# Altium schematic sheet AICat .SchDoc
size A3
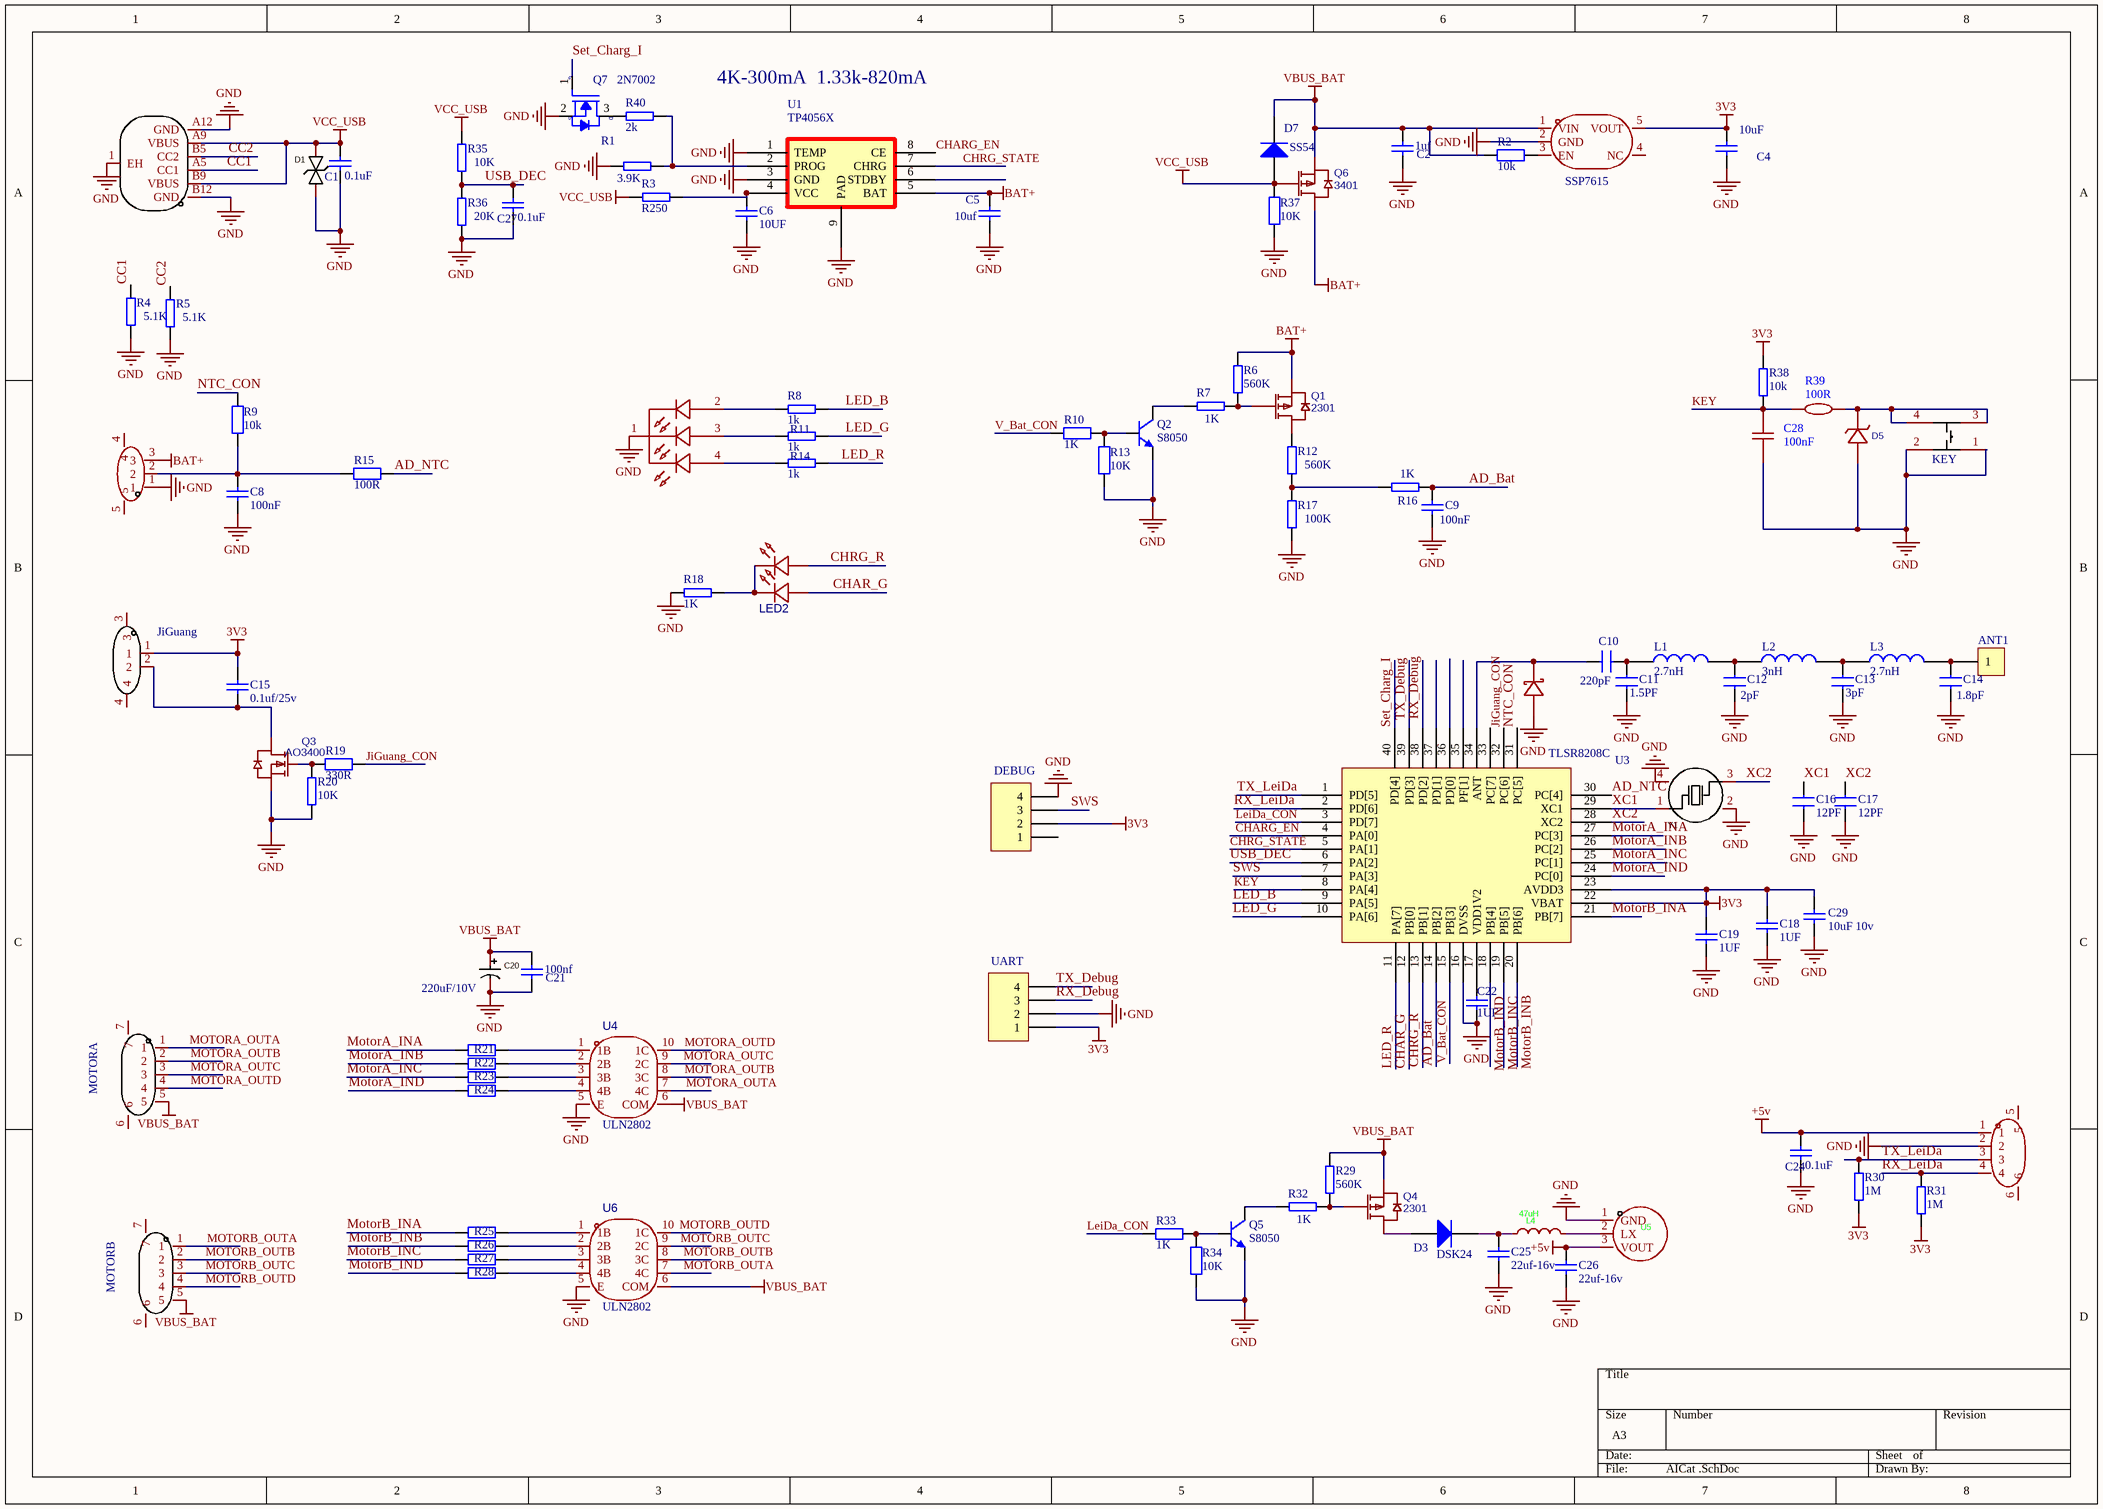
[diagram p0: AICat .SchDoc]

## Parts
ANT1  (no value)  [tp]
BAT1  BX-PH2.0-3PWT  [HDR-TH_3P-P2.50_ZX-XH2.54-3PWZ]  (value not drawn)
C1  0.1uF  [0603_C]
C2  1uf  [0603_C]
C4  10uF  [0603_C]
C5  10uf  [0603_C]
C6  10UF  [0603_c]
C8  100nF  [0603_C]
C9  100nF  [0603_C]
C10  220pF  [C0402]
C11  1.5PF  [C0402]
C12  2pF  [C0402]
C13  3pF  [C0402]
C14  1.8pF  [C0402]
C15  0.1uf/25v  [0603_C]
C16  12PF  [0603_c]
C17  12PF  [0603_c]
C18  1UF  [0603_c]
C19  1UF  [0603_c]
C20  220uF/10V  [SMD 6.3*5.4 电解]
C21  100nf  [0603_C]
C22  1UF  [0603_c]
C24  0.1uF  [0603_C]
C25  22uf-16v  [0805_c]
C26  22uf-16v  [0805_c]
C27  0.1uF  [0603_C]
C28  100nF  [0603_c]
C29  10uF 10v  [0603_C]
CN1  JiGuang  [CONN-SMD_2P-P1.25-LT]
CN2  HC-1.25-4PLT  [CONN-SMD_4P-P1.25_LT]  (value not drawn)
D1  SMF5.0CA_C726939  [SOD-123 双向]  (value not drawn)
D2  SE6V3LHN102T 6.3v单向  [0402-D]  (value not drawn)
D3  DSK24  [SOD-123FL]
D5  esd5z5.0t1g-ms  [SOD-523_L1.2-W0.8-LS1.6-RD]  (value not drawn)
D7  SS54  [SMA]
J1  MOTORA  [CONN-SMD_1.25-5PLT]
J2  MOTORB  [CONN-SMD_1.25-5PLT]
K1  KEY  [KEY_SMD_4P]
L1  2.7nH  [R0402]
L2  3nH  [R0402]
L3  2.7nH  [R0402]
L4  47uH  [IND-SMD_L3.5-W3.0_CD31]
LED1  XL-A3528RGBC-BM  [LED-ARRAY-SMD_4P-L3.2-W2.8-LS3.5-BL_XL-A3528RGBC-BM]  (value not drawn)
LED2  *  [LED-SMD_4P-L3.2-W1.6-TL_XL-3216SURUGC]  (value not drawn)
P1  DEBUG  [SIP4-2.54]
P2  UART  [SIP4-2.54]
Q1  2301  [SOT-23]
Q2  S8050  [SOT-23(SOT-23-3)]
Q3  AO3400  [SOT-23]
Q4  2301  [SOT-23]
Q5  S8050  [SOT-23(SOT-23-3)]
Q6  3401  [SOT-23]
Q7  2N7002  [SOT-23]
R1  3.9K  [0603_R]
R2  10k  [0603_R]
R3  R250  [1206_R]
R4  5.1K  [0603_R]
R5  5.1K  [0603_R]
R6  560K  [0603_R]
R7  1K  [0603_R]
R8  1k  [0603_R]
R9  10k  [0603_R]
R10  1K  [0603_r]
R11  1k  [0603_R]
R12  560K  [0603_R]
R13  10K  [0603_r]
R14  1k  [0603_R]
R15  100R  [0603_R]
R16  1K  [0603_R]
R17  100K  [0603_R]
R18  1K  [0603_R]
R19  330R  [0603_R]
R20  10K  [0603_R]
R21  330R  [0603_R]  (value not drawn)
R22  330R  [0603_R]  (value not drawn)
R23  330R  [0603_R]  (value not drawn)
R24  330R  [0603_R]  (value not drawn)
R25  330R  [0603_R]  (value not drawn)
R26  330R  [0603_R]  (value not drawn)
R27  330R  [0603_R]  (value not drawn)
R28  330R  [0603_R]  (value not drawn)
R29  560K  [0603_R]
R30  1M  [0603_R]
R31  1M  [0603_R]
R32  1K  [0603_R]
R33  1K  [0603_r]
R34  10K  [0603_r]
R35  10K  [0603_R]
R36  20K  [0603_R]
R37  10K  [0603_R]
R38  10k  [0603_R]
R39  100R  [0603_r]
R40  2k  [0603_R]
U1  TP4056X  [SOP8-9]
U2  SSP7615  [SOT-23-5]
U3  TLSR8208C  [QFN-40_L5.0-W5.0-P0.40-BL-EP3.7]
U4  ULN2802  [ESSOP-10]
U5  HE9116A50NR  [SOT-23]  (value not drawn)
U6  ULN2802  [ESSOP-10]
USB1  TYPE-C 6P  [TPYE-C-6]  (value not drawn)
Y1  24MHz +-20PPM  [CRYSTAL-SMD_4P-L3.2-W2.5]  (value not drawn)

## Nets
3V3: C4.2 C15.2 C18.1 C19.1 C29.2 CN1.1 P1.2 P2.1 R30.2 R31.2 R38.2 U2.5(VOUT) U3.22(VBAT) U3.23(AVDD3)
+5v: C24.2 C26.1 CN2.1 U5.3(VOUT)
BAT+: BAT1.3 C5.1 Q1.2(S) Q6.3(D) R6.1 U1.5(BAT)
GND: BAT1.1 C1.1 C2.1 C4.1 C5.2 C6.1 C8.2 C9.1 C11.1 C12.1 C13.1 C14.1 C16.1 C17.1 C18.2 C19.2 C20.2 C21.1 C22.1 C24.1 C25.2 C26.2 C27.1 C28.1 C29.1 CN2.2 D1.1 D2.2(A) D5.2(A) K1.1 K1.2 LED1.1 P1.4 P2.2 Q2.2(E) Q3.2(S) Q5.2(E) Q7.2(SOURCE) R1.1 R4.2 R5.2 R13.1 R17.2 R18.1 R20.1 R34.1 R36.2 R37.1 U1.1(TEMP) U1.3(GND) U1.9(PAD) U2.2(GND) U3.16(DVSS) U4.5(E) U5.1(GND) U6.5(E) USB1.1(EH) USB1.A12(GND) USB1.B12(GND) Y1.2(GND) Y1.4(GND)
VBUS_BAT: C2.2 C20.1 C21.2 D7.2(K) J1.5 J2.5 Q4.2(S) Q6.2(S) R2.1 R29.1 U2.1(VIN) U4.6(COM) U6.6(COM)
VCC_USB: C1.2 D1.2 D7.1(A) Q6.1(G) R3.2 R35.1 R37.2 USB1.A9(VBUS) USB1.B9(VBUS)
AD_Bat: C9.2 R16.1 U3.14(PB[2])
AD_NTC: R15.1 U3.30(PC[4])
CC1: R4.1 USB1.A5(CC1)
CC2: R5.1 USB1.B5(CC2)
CHAR_G: LED2.3(A) U3.12(PB[0])
CHARG_EN: U1.8(CE) U3.4(PA[0])
CHRG_R: LED2.1(A) U3.13(PB[1])
CHRG_STATE: U1.7(CHRG) U3.5(PA[1])
JiGuang_CON: R19.2 U3.32(PC[6])
KEY: C28.2 R38.1 R39.2 U3.8(PA[4])
LED_B: R8.2 U3.9(PA[5])
LED_G: R11.2 U3.10(PA[6])
LED_R: R14.2 U3.11(PA[7])
LeiDa_CON: R33.2 U3.3(PD[7])
MotorA_INA: R21.2 U3.27(PC[3])
MotorA_INB: R22.2 U3.26(PC[2])
MotorA_INC: R23.2 U3.25(PC[1])
MotorA_IND: R24.2 U3.24(PC[0])
MOTORA_OUTA: J1.1 U4.7(4C)
MOTORA_OUTB: J1.2 U4.8(3C)
MOTORA_OUTC: J1.3 U4.9(2C)
MOTORA_OUTD: J1.4 U4.10(1C)
MotorB_INA: R25.2 U3.21(PB[7])
MotorB_INB: R26.2 U3.20(PB[6])
MotorB_INC: R27.2 U3.19(PB[5])
MotorB_IND: R28.2 U3.18(PB[4])
MOTORB_OUTA: J2.1 U6.7(4C)
MOTORB_OUTB: J2.2 U6.8(3C)
MOTORB_OUTC: J2.3 U6.9(2C)
MOTORB_OUTD: J2.4 U6.10(1C)
NTC_CON: R9.2 U3.31(PC[5])
RX_Debug: P2.3 U3.38(PD[2])
RX_LeiDa: CN2.4 R31.1 U3.2(PD[6])
Set_Charg_I: Q7.1(GATE) U3.40(PD[4])
SWS: P1.3 U3.7(PA[3])
TX_Debug: P2.4 U3.39(PD[3])
TX_LeiDa: CN2.3 R30.1 U3.1(PD[5])
USB_DEC: C27.2 R35.2 R36.1 U3.6(PA[2])
V_Bat_CON: R10.2 U3.15(PB[3])
XC1: C16.2 U3.29(XC1) Y1.1(OSC1)
XC2: C17.2 U3.28(XC2) Y1.3(OSC2)
NetANT1_1: ANT1.1 C14.2 L3.2
NetBAT1_2: BAT1.2 C8.1 R9.1 R15.2
NetC6_2: C6.2 R3.1 U1.4(VCC)
NetC10_1: C10.1 D2.1(C) U3.34(ANT)
NetC10_2: C10.2 C11.2 L1.1
NetC12_2: C12.2 L1.2 L2.1
NetC13_2: C13.2 L2.2 L3.1
NetC15_1: C15.1 CN1.2 Q3.3(D)
NetC22_2: C22.2 U3.17(VDD1V2)
NetC25_1: C25.1 D3.2(K) L4.1
NetD3_1: D3.1(A) Q4.3(D)
NetD5_1: D5.1(C) K1.3 K1.4 R39.1
NetL4_2: L4.2 U5.2(LX)
NetLED1_2: LED1.2 R8.1
NetLED1_3: LED1.3 R11.1
NetLED1_4: LED1.4 R14.1
NetLED2_2: LED2.2(K) LED2.4(K) R18.2
NetQ1_1: Q1.1(G) R6.2 R7.1
NetQ1_3: Q1.3(D) R12.1
NetQ2_1: Q2.1(B) R10.1 R13.2
NetQ2_3: Q2.3(C) R7.2
NetQ3_1: Q3.1(G) R19.1 R20.2
NetQ4_1: Q4.1(G) R29.2 R32.1
NetQ5_1: Q5.1(B) R33.1 R34.2
NetQ5_3: Q5.3(C) R32.2
NetQ7_3: Q7.3(DRAIN) R40.1
NetR1_2: R1.2 R40.2 U1.2(PROG)
NetR2_2: R2.2 U2.3(EN)
NetR12_2: R12.2 R16.2 R17.1
NetR21_1: R21.1 U4.1(1B)
NetR22_1: R22.1 U4.2(2B)
NetR23_1: R23.1 U4.3(3B)
NetR24_1: R24.1 U4.4(4B)
NetR25_1: R25.1 U6.1(1B)
NetR26_1: R26.1 U6.2(2B)
NetR27_1: R27.1 U6.3(3B)
NetR28_1: R28.1 U6.4(4B)

Not connected (* = marked no-connect by the designer): BAT1 4 5; CN1 3 4; CN2 5 6; J1 6 7; J2 6 7; P1 1; U1 6(STDBY); U2 4(NC); U3 33(PC[7]) 35(PF[1]) 36(PD[0]) 37(PD[1])

## Notes on the sheet
- 4K-300mA  1.33k-820mA
- (in symbol AO3400_SOT23) G; S; D

## Library data of the parts
ANT1 = CON1: Connector
BAT1 = BX-PH2.0-3PWT: Add into BOM: yes; Pins Structure: 1x3P; Pitch: 2mm; Reference Series: PH; Number of PINs Per Row: 3; Current Rating: 2A; Voltage Rating: 250V; Plastic Material: LCP; Z-Height of the Board: 5.6mm; X-Length of Bottom Edge on Board (Spacing Line): 10mm; Y-Width of Bottom Edge on Board: 8.5mm; Symbol: BX-PH2.0-3P WT; Device: BX-PH2.0-3PWT; Supplier Part: C18077891; Manufacturer Part: BX-PH2.0-3PWT; JLCPCB Part Class: Extended Part; Datasheet: https://atta.szlcsc.com/upload/public/pdf/source/20231017/BD792FFC28D3713F37031213153FD38E.pdf; Supplier: LCSC; Convert to PCB: yes; Number of Pins: 3P; Number of Rows: 1; Row Spacing: -; Flame Retardant Rating: -
C1 C24 C27 = Cap: Capacitor; Value: 50V/0.1uF/0603; Published: 8-Jun-2000; Revision: July-2002: Re-released for DXP Platform.; Publisher: Altium Limited
C2 C21 C25 C26 = Cap1: 无极电容
C4 C5 C15 C29 = Cap: Capacitor; Value: 10nF; Published: 8-Jun-2000; Revision: July-2002: Re-released for DXP Platform.; Publisher: Altium Limited
C6 C8 C9 C18 C19 C22 = CAP
C10-C14 C16 C17 = CAP: Capacitor
C20 = RVT1A221M0605_C72494: Symbol: RVT1A221M0605-C72494; Value: 220uF; Add into BOM: yes; Rated Voltage: 10V; Ripple Current: 90mA@120Hz; L: 5.4mm; Device: RVT1A221M0605_C72494; Supplier: LCSC; Manufacturer Part: RVT1A221M0605; Supplier Part: C72494; JLCPCB Part Class: Extended Part; Supplier Footprint: SMD,D6.3xL5.4mm; Datasheet: https://atta.szlcsc.com/upload/public/pdf/source/20170325/1490427950282.pdf; Convert to PCB: yes; Equivalent Series Resistance(ESR): -
C28 = CAP_0603: Symbol: CapAcitance; Convert to PCB: yes; Device: CAP_0603; Add into BOM: yes; Supplier Footprint: 0603; Value: 100nF
CN1 = HC-1.25-2PLT: Add into BOM: yes; Pins Structure: 1x2P; Pitch: 1.25mm; Number of PINs Per Row: 2; Current Rating (Max): 2A; Symbol: HC-1.25-2PLT; Device: HC-1.25-2PLT; Supplier Part: C2845388; Manufacturer Part: HC-1.25-2PLT; Supplier Footprint: SMD,P=1.25mm; JLCPCB Part Class: Extended Part; Datasheet: https://atta.szlcsc.com/upload/public/pdf/source/20230707/8E5913B5A3195C18F5EE12EA4CB86B82.pdf; Supplier: LCSC; Convert to PCB: yes; Reference Series: -; Number of Pins: 2P; Number of Rows: 1; Row Spacing: -
D1 = SMF5.0CA_C726939: Add into BOM: yes; Symbol: SMF5.0CA_C726939; Device: SMF5.0CA_C726939; Supplier: LCSC; Supplier Part: C726939; Manufacturer Part: SMF5.0CA; JLCPCB Part Class: Extended Part; LCSC Part Name: SMF5.0CA; Supplier Footprint: SOD-123FL; Datasheet: https://atta.szlcsc.com/upload/public/pdf/source/20200825/C726891_B615A55314C94A3B16B7FBCD32D40567.pdf; Convert to PCB: yes
D2 = TPNSR05F20NXT5G: Symbol: TPNSR05F20NXT5G
D3 D7 = Diode 1N4148: High Conductance Fast Diode; Published: 8-Jun-2000; LatestRevisionDate: 17-Jul-2002; LatestRevisionNote: Re-released for DXP Platform.; DatasheetVersion: 1997; PackageReference: DO-35; Publisher: Altium Limited; PackageDescription: Diode, Axial; Body 3.8 x 1.9 mm (LxDia. max), Lead Dia. 0.53 mm (max); Code_JEDEC: DO-204-AH; ComponentLink1Description: Manufacturer Link; ComponentLink1URL: http://www.fairchildsemi.com/; ComponentLink2Description: Datasheet; ComponentLink2URL: http://www.fairchildsemi.com/ds/1N%2F1N4148.pdf
D5 = esd5z5.0t1g-ms: AddInBom: yes; ModelId: 8f56a03db567494d8f4c9d12aa52a741; ModelName: SOD-523_L1.2-W0.8-H0.7-LS1.6; ModelTransform: 62.992,31.496,0,180,0,0,0,0,0; Reverse Stand-Off Voltage (Vrwm): 5V; Clamping Voltage: 18.6V; Peak Pulse Current (Ipp): 9.4A; Peak Pulse Power Dissipation (Ppp): 200W; Voltage - Breakdown: 6.2V; Reverse Leakage Current (Ir): 1uA; level of protection: IEC 61000-4-2; Type: ESD; Symbol: ESD5Z5.0T1G-MS; SupplierPart: C3008120; ManufacturerPart: ESD5Z5.0T1G-MS; Supplier Footprint: SOD-523; JLCPCB Part Class: Extended Part; Datasheet: https://item.szlcsc.com/datasheet/ESD5Z5.0T1G-MS/3498468.html; Supplier: LCSC; ConvertToPcb: yes; FootprintName: SOD-523_L1.2-W0.8-LS1.6-RD; Number of Channels: -; Operating Temperature: -; Junction Capacitance: -
J1 J2 = HC-1.25-5PLT: Add into BOM: yes; Pins Structure: 1x5P; Pitch: 1.25mm; Number of PINs Per Row: 5; Current Rating (Max): 2A; Symbol: HC-1.25-5PLT; Device: HC-1.25-5PLT; Supplier Part: C2845391; Manufacturer Part: HC-1.25-5PLT; Supplier Footprint: SMD,P=1.25mm; JLCPCB Part Class: Extended Part; Datasheet: https://atta.szlcsc.com/upload/public/pdf/source/20230707/8E5913B5A3195C18F5EE12EA4CB86B82.pdf; Supplier: LCSC; Convert to PCB: yes; Reference Series: -; Number of Pins: 5P; Number of Rows: 1; Row Spacing: -
K1 = TS-1002S-05026C: Add into BOM: yes; Switch Length: 6mm; Switch Height: 5mm; Contact Current: 50mA; Voltage Rating (DC): 12V; Symbol: TS-1002S-05026C; Device: TS-1002S-05026C; Supplier: LCSC; Supplier Part: C455110; Manufacturer Part: TS-1002S-05026C; JLCPCB Part Class: Extended Part; Supplier Footprint: SMD,6x6mm; Datasheet: https://atta.szlcsc.com/upload/public/pdf/source/20191118/C455126_F61E8FA1ED640FB1CE0B30B55DEB62E3.pdf; Convert to PCB: yes; Switch Width: 6mm; With Lamp: -; Mechanical Life: -
L1-L3 = INDUCTOR
L4 = CD31-470M 47UH: Add into BOM: yes; Current Rating: 260mA; Symbol: CD31-470M 47UH; Device: CD31-470M 47UH; Supplier Part: C2827870; Manufacturer Part: CD31-470M 47UH; Supplier Footprint: SMD; JLCPCB Part Class: Extended Part; Datasheet: https://atta.szlcsc.com/upload/public/pdf/source/20210426/C2827870_C1DAB061982EB9B8C66EF61342A73E29.pdf; Supplier: LCSC; Convert to PCB: yes; Value: 47uH; Type: -; Ratings: -
LED2 = TJ-S2012SW8TCGLC2R2G-A5: Symbol: TJ-S2012SW8TCGLC2R2G-A5
P1 P2 = Header 4: Header, 4-Pin; LatestRevisionDate: 17-Jul-2002; LatestRevisionNote: Re-released for DXP Platform.; Publisher: Altium Limited
Q1 Q4 Q6 = CJ3401: BOM_Manufacturer: CJ; BOM_Supplier: LCSC; BOM_Manufacturer Part: CJ3401; BOM_Supplier Part: C13799; BOM_JLCPCB Part Class: Extended Part; spicePre: Q; spiceSymbolName: CJ3401
Q2 Q5 = NPN_sot23: NPN三极管
Q3 = JMTL3400A: Contributor: LCSC; BOM_Supplier: LCSC; BOM_Supplier Part: C2890442; BOM_Manufacturer Part: JMTL3400A; BOM_JLCPCB Part Class: Extended Part; spicePre: Q; spiceSymbolName: JMTL3400A
Q7 = AO3400_SOT23: BOM: N-Channel EMFET 2N7002 SOT23 <FAIRCHILD>; COST(NT$): 4.69
R1 R3-R8 R11 R12 R14 R16-R18 R20 R29-R32 R35 R36 R38 R40 = RES
R2 R9 R10 R13 R15 R19 R21-R28 R33 R34 R37 = Res2: Resistor; Value: 120R; Published: 8-Jun-2000; LatestRevisionDate: 17-Jul-2002; LatestRevisionNote: Re-released for DXP Platform.; PackageReference: AXIAL-0.4; Publisher: Altium Limited
R39 = Res_0603: Convert to PCB: yes; Device: Res_0603; Add into BOM: yes; Supplier Footprint: 0603; Value: 100R
U1 = TP4056
U2 = SSP7615-33M5R: Symbol: SSP7615-33M5R
U4 U6 = ULN2802_C2828555: Symbol: ULN2802_C2828555
U5 = HE9116A50NR: Add into BOM: yes; Output Voltage: 5V; Frequency - Switching: 350kHz; Number of Outputs: 1; Symbol: HE9116A50NR; Device: HE9116A50NR; Supplier Part: C41366987; Manufacturer Part: HE9116A50NR; Supplier Footprint: SOT-23; JLCPCB Part Class: Extended Part; Datasheet: https://atta.szlcsc.com/upload/public/pdf/source/20240826/EE73109CCFC801CC8088EB9CDEFA9A93.pdf; Supplier: LCSC; Convert to PCB: yes; Output Type: -; Voltage - Supply: -; Output Current: -; Quiescent Current: -; Switch tube (built-in/external): -
USB1 = TYPE-C 6P LTH6.5: Add into BOM: yes; Number of Ports: 1; Current Rating - Power (Max): 3A; Symbol: TYPE-C 6P LTH6.5; Device: TYPE-C 6P LTH6.5; Supplier: LCSC; Supplier Part: C5187463; Manufacturer Part: TYPE-C 6P LTH6.5; JLCPCB Part Class: Extended Part; Supplier Footprint: SMD; Datasheet: https://atta.szlcsc.com/upload/public/pdf/source/20220929/CF5EB2C50F637B805AA82EC2C8F335C3.pdf; Convert to PCB: yes; Connector Type: Type-C; Number of Contacts: 6P
Y1 = TAXM13.56M4RLBCCT2T: Name: 13.56MHz; Add into BOM: yes; Value: 13.56MHz; External load capacitor: 20pF; Device: TAXM13.56M4RLBCCT2T; Supplier Part: C164051; Manufacturer Part: TAXM13.56M4RLBCCT2T; Supplier Footprint: SMD3225-4P; JLCPCB Part Class: Extended Part; Datasheet: https://atta.szlcsc.com/upload/public/pdf/source/20171225/C164051_15141924799131203407.pdf; Supplier: LCSC; Convert to PCB: yes
CN2 = HC-1.25-4PLT: Symbol: HC-1.25-4PLT
LED1 = XL-A3528RGBC-BM: Symbol: XL-A3528RGBC-BM